# EAGLE design IC test1 (EAGLE 6.6.0)
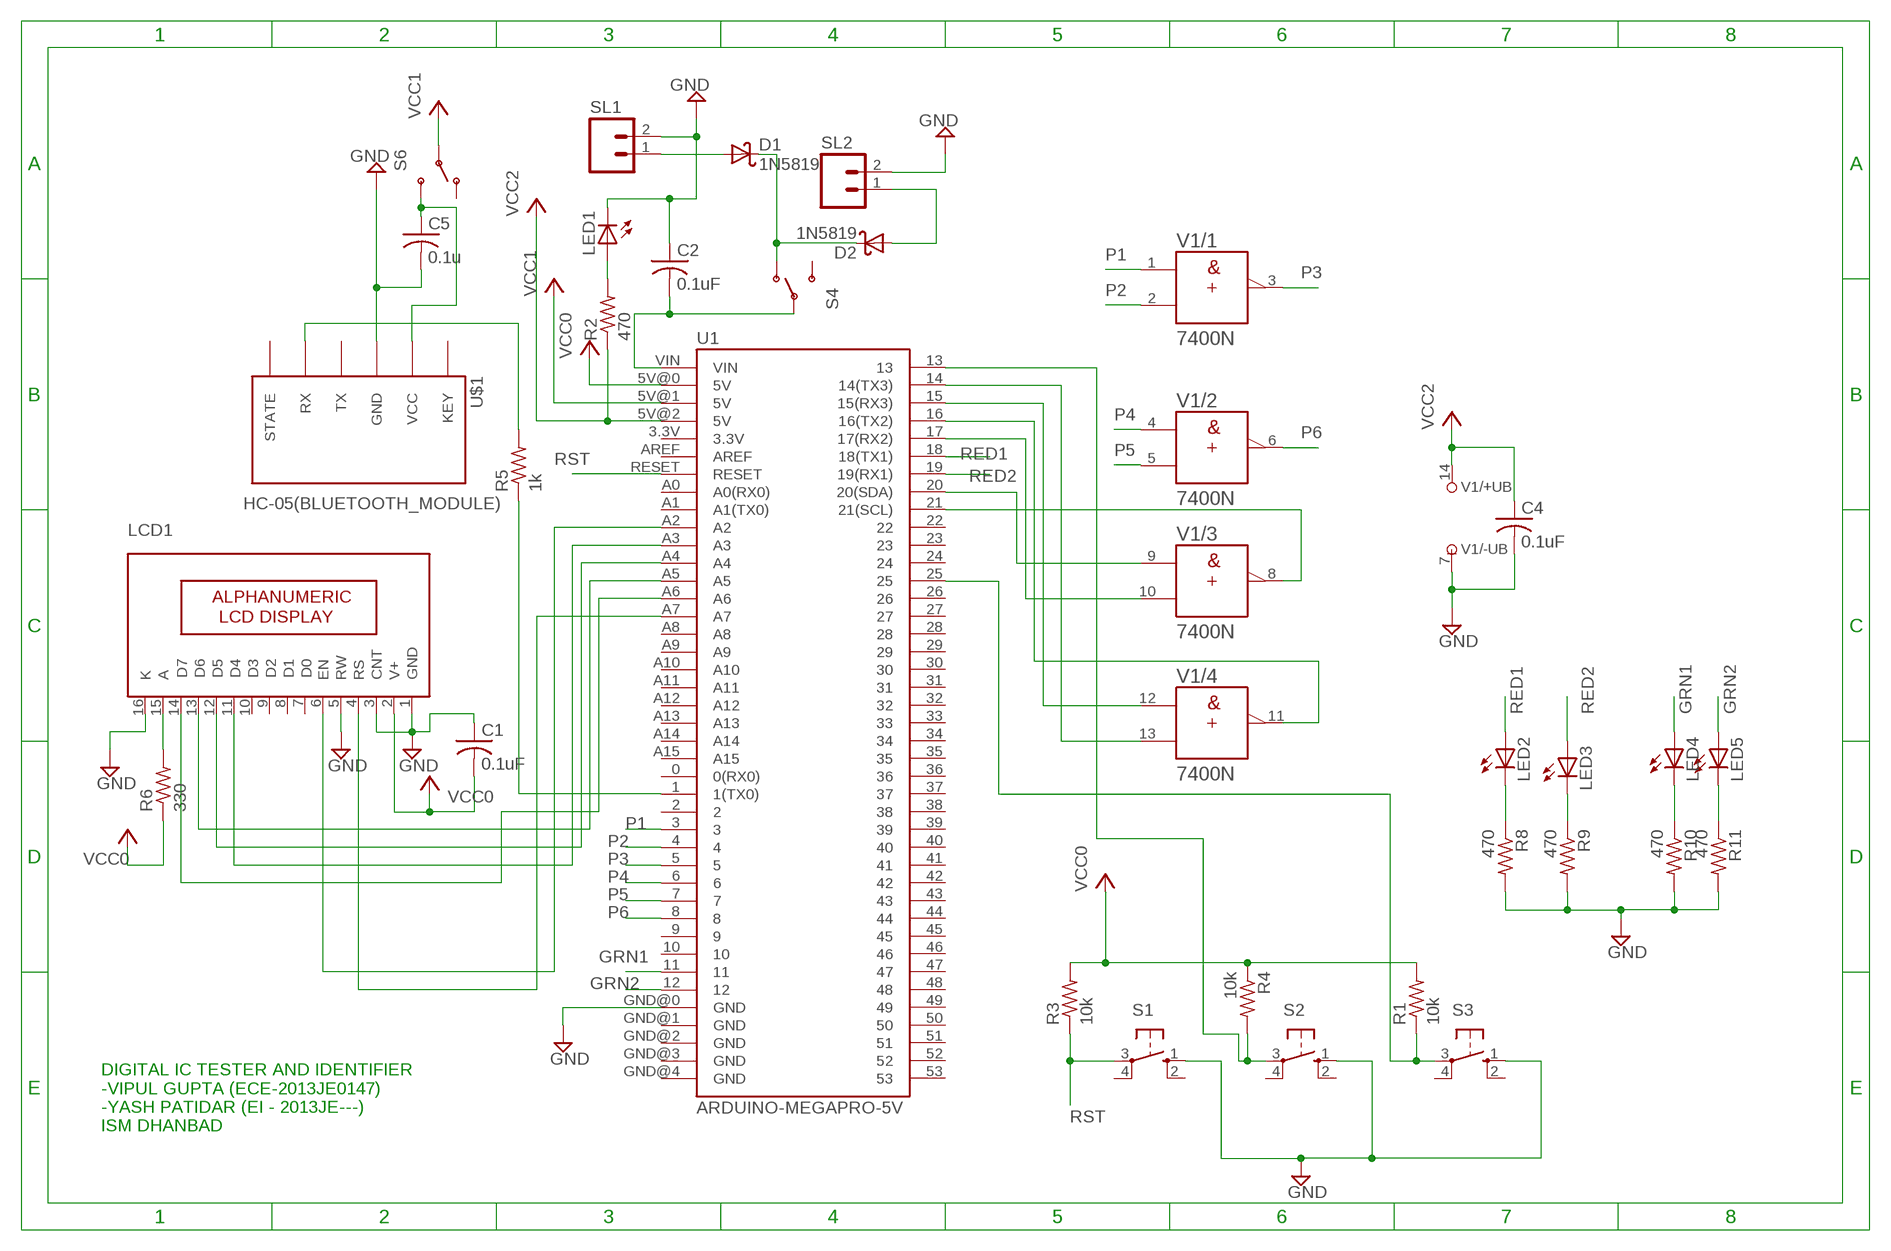
[diagram p0: schematic, sheet 1]

## Parts
C1  0.1uF  C-US025-024X044  [C025-024X044]
C2  0.1uF  C-US025-024X044  [C025-024X044]
C4  0.1uF  C-US025-024X044  [C025-024X044]
C5  0.1u  C-US025-024X044  [C025-024X044]
D1  1N5819  [DO41-10]
D2  1N5819  [DO41-10]
LCD1  16X2LCD  [16X2_LCD]
LED1  LED5MM  [LED5MM]
LED2  LED5MM  [LED5MM]
LED3  LED5MM  [LED5MM]
LED4  LED5MM  [LED5MM]
LED5  LED5MM  [LED5MM]
R1  10k  R-US_0204/7  [0204/7]
R2  470  R-US_0204/7  [0204/7]
R3  10k  R-US_0204/7  [0204/7]
R4  10k  R-US_0204/7  [0204/7]
R5  1k  R-US_0204/7  [0204/7]
R6  330  R-US_0204/7  [0204/7]
R8  470  R-US_0204/7  [0204/7]
R9  470  R-US_0204/7  [0204/7]
R10  470  R-US_0204/7  [0204/7]
R11  470  R-US_0204/7  [0204/7]
S1  40-XX  [B3F-40XX]
S2  40-XX  [B3F-40XX]
S3  40-XX  [B3F-40XX]
S4  SWITCH-SPDTPTH  [SWITCH-SPDT]
S6  SWITCH-SPDTPTH  [SWITCH-SPDT]
SL1  M02  [02P]
SL2  M02  [02P]
U1  ARDUINO-MEGAPRO-5V  [ARDUINO_MEGA-PRO-5V]
U$1  HC-05(BLUETOOTH_MODULE)  [HC-05]
V1  7400N  [DIL14]

## Nets
GND: C1.1 C2.1 C4.2 C5.2 LCD1.1(GND) LCD1.3(CNT) LCD1.5(RW) LCD1.16(K) LED1.K(C) R8.2 R9.2 R10.2 R11.2 S1.1(S) S2.1(S) S3.1(S) SL1.2 SL2.2 U1.GND@0(GND) U$1.GND V1.7(/-UB:-UB)
GRN1: LED4.A U1.11
GRN2: LED5.A U1.12
N$1: LCD1.15(A) R6.2
N$2: R5.2 U$1.RX
N$3: LCD1.4(RS) U1.A7
N$4: LCD1.6(EN) U1.A2
N$5: LCD1.11(D4) U1.A3
N$6: LCD1.12(D5) U1.A4
N$7: LCD1.13(D6) U1.A5
N$8: LCD1.14(D7) U1.A6
N$10: D1.C D2.C S4.1(O)
N$11: D2.A SL2.1
N$12: C2.2 S4.2(P) U1.VIN
N$13: D1.A SL1.1
N$14: C5.1 S6.3(S) U$1.VCC
N$15: U1.14(14(TX3)) V1.13(/4:B)
N$16: R4.2 S2.3(P) U1.13
N$17: R1.1 S3.3(P) U1.25
N$18: U1.15(15(RX3)) V1.12(/4:A)
N$19: LED1.A R2.2
N$20: U1.16(16(TX2)) V1.11(/4:Y)
N$21: U1.17(17(RX2)) V1.10(/3:B)
N$22: U1.20(20(SDA)) V1.9(/3:A)
N$23: U1.21(21(SCL)) V1.8(/3:Y)
N$29: LED2.K(C) R8.1
N$30: LED3.K(C) R9.1
N$31: LED4.K(C) R10.1
N$32: LED5.K(C) R11.1
N$33: R5.1 U1.1(1(TX0))
P1: U1.3 V1.1(/1:A)
P2: U1.4 V1.2(/1:B)
P3: U1.5 V1.3(/1:Y)
P4: U1.6 V1.4(/2:A)
P5: U1.7 V1.5(/2:B)
P6: U1.8 V1.6(/2:Y)
RED1: LED2.A U1.18(18(TX1))
RED2: LED3.A U1.19(19(RX1))
RST: R3.1 S1.3(P) U1.RESET
VCC0: C1.2 LCD1.2(V+) R1.2 R3.2 R4.1 R6.1 U1.5V@0(5V) ; supply symbol labelled VCC
VCC3: R2.1 S6.2(P) U1.5V@2(5V) ; supply symbol labelled VCC2, VCC1
VCC4: C4.1 U1.5V@1(5V) V1.14(/+UB:+UB) ; supply symbol labelled VCC1, VCC2
Unconnected: LCD1.7(D0) LCD1.8(D1) LCD1.9(D2) LCD1.10(D3) S1.2(S1) S1.4(P1) S2.2(S1) S2.4(P1) S3.2(S1) S3.4(P1) S4.3(S) S6.1(O) U1.0(0(RX0)) U1.2 U1.3.3V U1.9 U1.10 U1.22 U1.23 U1.24 U1.26 U1.27 U1.28 U1.29 U1.30 U1.31 U1.32 U1.33 U1.34 U1.35 U1.36 U1.37 U1.38 U1.39 U1.40 U1.41 U1.42 U1.43 U1.44 U1.45 U1.46 U1.47 U1.48 U1.49 U1.50 U1.51 U1.52 U1.53 U1.A0(A0(RX0)) U1.A1(A1(TX0)) U1.A8 U1.A9 U1.A10 U1.A11 U1.A12 U1.A13 U1.A14 U1.A15 U1.AREF U1.GND@1(GND) U1.GND@2(GND) U1.GND@3(GND) U1.GND@4(GND) U$1.KEY U$1.STATE U$1.TX

## Notes on the sheet
- DIGITAL IC TESTER AND IDENTIFIER
  -VIPUL GUPTA (ECE-2013JE0147)
  -YASH PATIDAR (EI - 2013JE---)
  ISM DHANBAD

## Library data of the parts
C1 C2 C4 C5 = resistor:C-US: CAPACITOR, American symbol
D1 D2 = CEDT_JANUARY_2015_v5:1N5819: DIODE general purpose rectifier, 1 A
LCD1 = CEDT_JANUARY_2015_v5:16X2LCD: ALPHANUMERIC-LCD
LED1-LED5 = CEDT_JANUARY_2015_v5:LED
R1-R6 R8-R11 = rcl:R-US_: RESISTOR, American symbol
S1-S3 = switch-omron:40-XX: OMRON SWITCH; MF: OMRON COMPONENTS USA; MPN: B3F-4000; OC_FARNELL: 176434; OC_NEWARK: 36K3105
S4 S6 = SparkFun-Electromechanical:SWITCH-SPDT: SPDT Switch Simple slide switch, Spark Fun Electronics SKU : COM-00102 DPDT SMT slide switch, AYZ0202, SWCH-08179; PROD_ID: SWCH-08261
SL1 SL2 = CEDT_JANUARY_2015_v5:M02: AMP QUICK CONNECTOR
U1 = SparkFun-Boards:ARDUINO-MEGA: Arduino Mega board footprint
U$1 = CEDT_JANUARY_2015_v5:HC-05(BLUETOOTH_MODULE)
V1 = 74ttl-din:74*00: Quad 2-input NAND gate

## Net classes
0 default: width 0.406 mm
1 VCC: width 0.61 mm

## Board
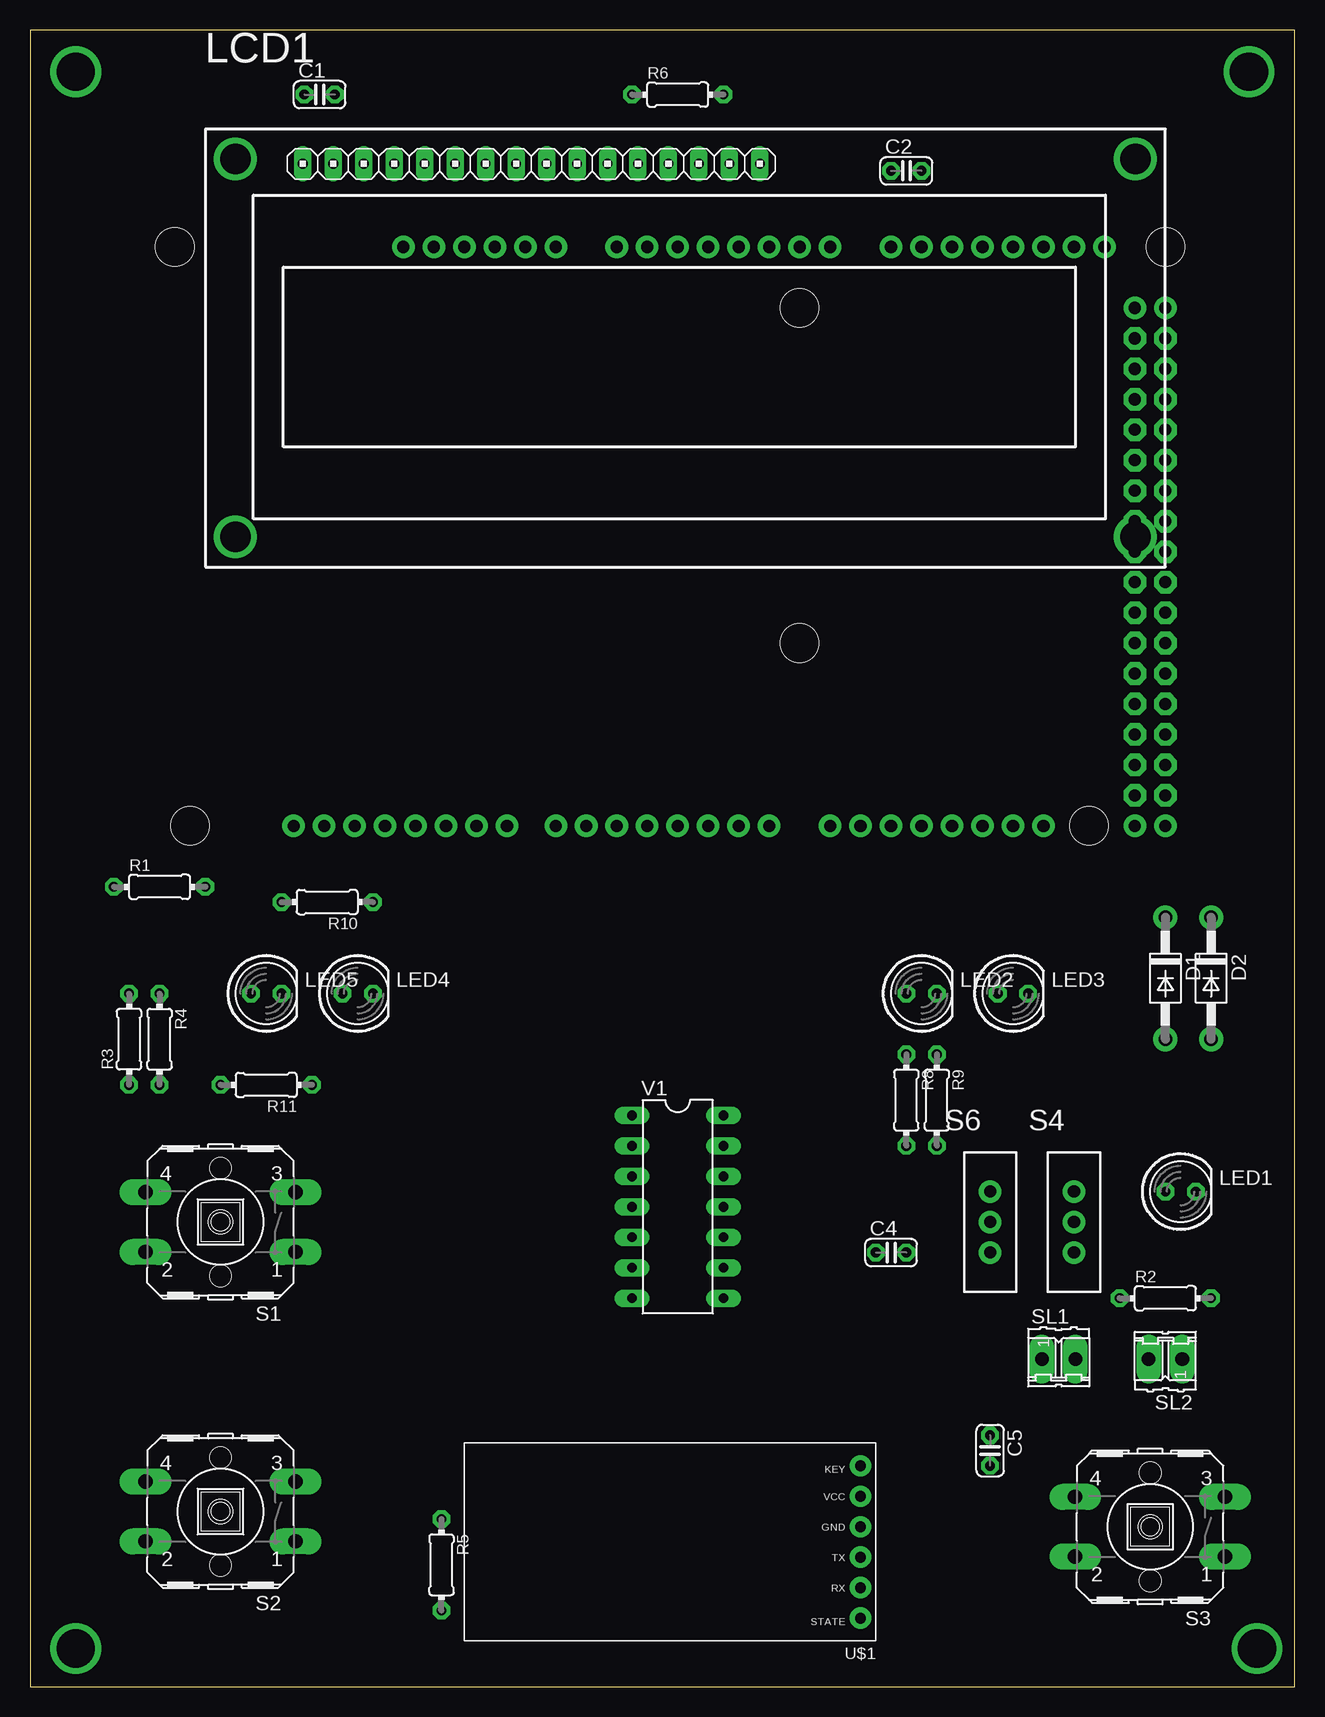
[diagram p1: board, top side]
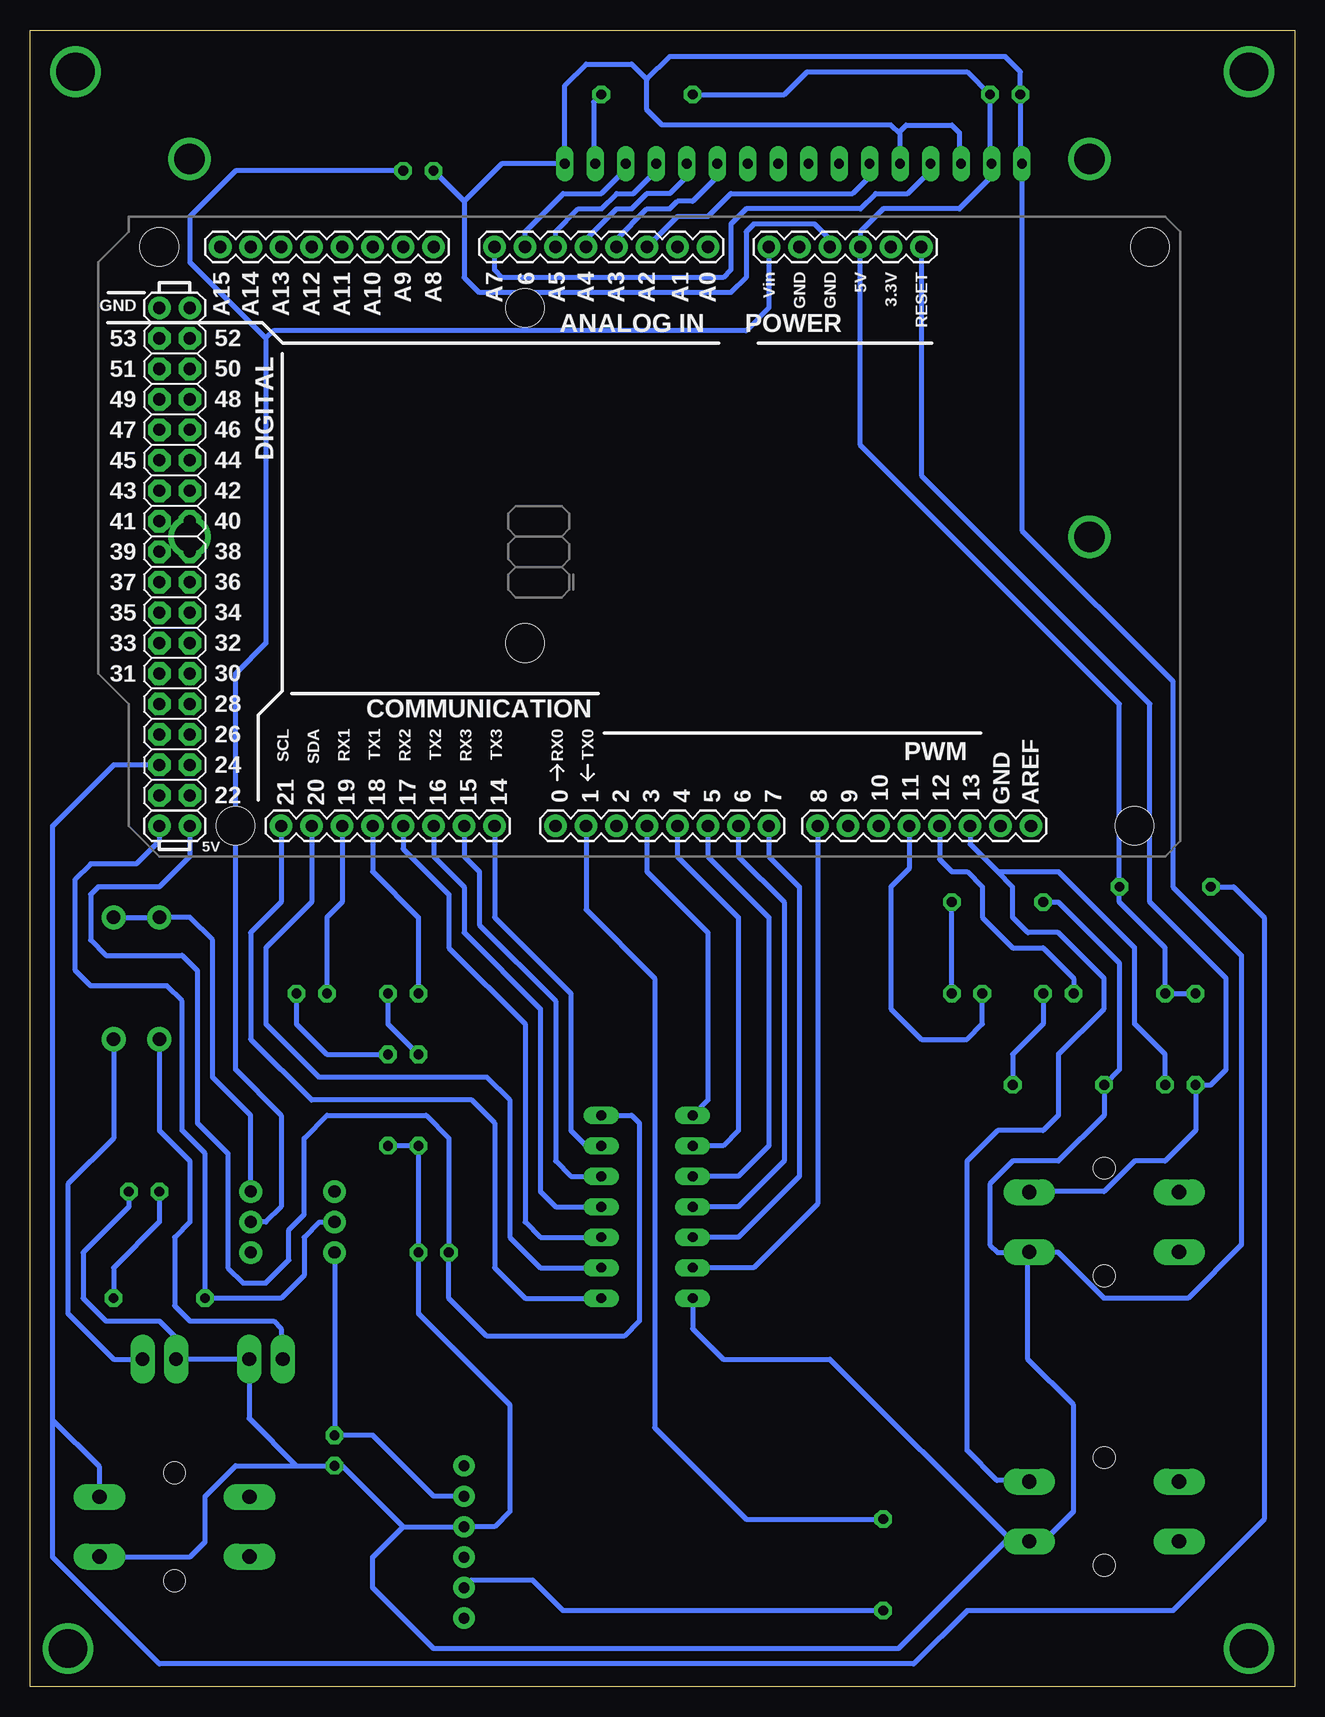
[diagram p2: board, bottom side, seen from below]

Size 105.39 x 138.1 mm. Coordinates in mm from the lower left corner, seen from the top.
Outline: 0,0 105.39,0 105.39,138.1 0,138.1 0,0
Copper layers (1*16): Top 0.035mm / dielectric 1.5mm / Bottom 0.035mm
Design rules "default *": minimum track width 10mil, minimum drill 24mil, track to track 8mil, track to pad 8mil, pad to pad 8mil, via to via 8mil, smd to smd 8mil, copper to edge 40mil, drill to drill 8mil, minimum pad ring 10mil, minimum via ring 8mil, stop-mask expansion 4mil, vias tented up to drill 0mil, thermal gap 10mil

### Footprints (pad centres in the part's own frame; a part is rotated, then mirrored left to right if it is on the bottom)
C025-024X044 = drill 0.813 octagon: 1 -1.27,0; 2 1.27,0
DO41-10 = drill 1.118: A 5.08,0; C -5.08,0
16X2_LCD = drill 0.813 long: 1 8.12,33.608; 2 10.66,33.608; 3 13.2,33.608; 4 15.74,33.608; 5 18.28,33.608; 6 20.82,33.608; 7 23.36,33.608; 8 25.9,33.608; 9 28.44,33.608; 10 30.98,33.608; 11 33.52,33.608; 12 36.06,33.608; 13 38.6,33.608; 14 41.14,33.608; 15 43.68,33.608; 16 46.22,33.608 | drill 2.54: P$1 2.5,34; P$2 2.5,2.5; P$3 77.5,2.5; P$4 77.5,34
LED5MM = drill 0.813 octagon: A -1.27,0; K 1.27,0
0204/7 = drill 0.813 octagon: 1 -3.81,0; 2 3.81,0
B3F-40XX = drill 1.194 long: 1 -6.248,2.489; 2 6.248,2.489; 3 -6.248,-2.489; 4 6.248,-2.489 | hole 1.803: 0,-4.496; 0,4.496
SWITCH-SPDT = drill 1.016 pad 1.88: 1 0,2.54; 2 0,0; 3 0,-2.54
02P = drill 1.143 long: 1 -1.397,0; 2 1.397,0
ARDUINO_MEGA-PRO-5V = drill 1.016 pad 1.88: 0 52.07,50.8; 1 49.53,50.8; 2 46.99,50.8; 3 44.45,50.8; 3.3V 24.13,2.54; 4 41.91,50.8; 5 39.37,50.8; 5V@0 26.67,2.54; 5V@1 82.55,50.8; 5V@2 85.09,50.8; 6 36.83,50.8; 7 34.29,50.8; 8 30.226,50.8; 9 27.686,50.8; 10 25.146,50.8; 11 22.606,50.8; 12 20.066,50.8; 13 17.526,50.8; 14 57.15,50.8; 15 59.69,50.8; 16 62.23,50.8; 17 64.77,50.8; 18 67.31,50.8; 19 69.85,50.8; 20 72.39,50.8; 21 74.93,50.8; A0 39.37,2.54; A1 41.91,2.54; A2 44.45,2.54; A3 46.99,2.54; A4 49.53,2.54; A5 52.07,2.54; A6 54.61,2.54; A7 57.15,2.54; A8 62.23,2.54; A9 64.77,2.54; A10 67.31,2.54; A11 69.85,2.54; A12 72.39,2.54; A13 74.93,2.54; A14 77.47,2.54; A15 80.01,2.54; AREF 12.446,50.8; GND@0 29.21,2.54; GND@1 31.75,2.54; GND@2 82.55,7.62; GND@3 85.09,7.62; GND@4 14.986,50.8; RESET 21.59,2.54; VIN 34.29,2.54 | drill 1.016 pad 1.88 octagon: 22 82.55,48.26; 23 85.09,48.26; 24 82.55,45.72; 25 85.09,45.72; 26 82.55,43.18; 27 85.09,43.18; 28 82.55,40.64; 29 85.09,40.64; 30 82.55,38.1; 31 85.09,38.1; 32 82.55,35.56; 33 85.09,35.56; 34 82.55,33.02; 35 85.09,33.02; 36 82.55,30.48; 37 85.09,30.48; 38 82.55,27.94; 39 85.09,27.94; 40 82.55,25.4; 41 85.09,25.4; 42 82.55,22.86; 43 85.09,22.86; 44 82.55,20.32; 45 85.09,20.32; 46 82.55,17.78; 47 85.09,17.78; 48 82.55,15.24; 49 85.09,15.24; 50 82.55,12.7; 51 85.09,12.7; 52 82.55,10.16; 53 85.09,10.16 | hole 3.2: 3.81,50.8; 2.54,2.54; 54.61,35.56; 54.61,7.62; 78.74,50.8; 85.09,2.54
HC-05 = drill 0.9 pad 1.778: GND -16.51,-1.27; KEY -16.51,-6.35; RX -16.51,3.81; STATE -16.51,6.35; TX -16.51,1.27; VCC -16.51,-3.81
DIL14 = drill 0.813 long: 1 -7.62,-3.81; 2 -5.08,-3.81; 3 -2.54,-3.81; 4 0,-3.81; 5 2.54,-3.81; 6 5.08,-3.81; 7 7.62,-3.81; 8 7.62,3.81; 9 5.08,3.81; 10 2.54,3.81; 11 0,3.81; 12 -2.54,3.81; 13 -5.08,3.81; 14 -7.62,3.81

### Placement (x,y rotation side)
C1  24.13,132.72 0 top
C2  73.03,126.36 0 top
C4  71.75,36.2 0 top
C5  80.01,19.68 270 top
D1  94.61,59.05 270 top
D2  98.42,59.05 270 top
LCD1  14.61,93.34 0 top
LED1  95.89,41.27 0 top
LED2  74.3,57.78 0 top
LED3  81.92,57.78 0 top
LED4  27.3,57.78 0 top
LED5  19.68,57.78 0 top
R1  10.79,66.67 0 top
R2  94.61,32.38 0 top
R3  8.26,53.98 90 top
R4  10.79,53.98 270 top
R5  34.29,10.16 270 top
R6  53.98,132.72 0 top
R8  73.03,48.9 270 top
R9  75.56,48.9 270 top
R10  24.77,65.41 180 top
R11  19.68,50.16 180 top
S1  15.88,38.73 180 top
S2  15.88,14.61 180 top
S3  93.34,13.34 180 top
S4  87,38.73 0 top
S6  80.01,38.73 0 top
SL1  85.72,27.3 0 top
SL2  94.61,27.3 180 top
U1  9.53,122.56 180 bottom
U$1  52.7,12.06 180 top
V1  53.98,40.01 270 top

### Tracks (layer width: path | path; a pad name or v marks a point on that pad's centre or on a via)
GND
  Bottom 0.406: 32.88,129.41 LCD1.5 33.07,126.95 | 32.88,129.41 33.66,130.18 52.7,130.18 53.98,131.44 53.98,133.99 | 53.98,133.99 55.24,135.25 59.05,135.25 60.83,133.49 LCD1.16 66.09,126.95 69.22,123.83 | 53.98,133.99 52.07,135.89 24.13,135.89 22.86,134.62 C1.1 22.86,127.09 LCD1.1 22.73,96.39 10.16,83.82 10.16,66.67 4.45,60.96 4.45,36.83 8.89,32.38 15.88,32.38 19.74,36.25 S1.1 | U1.GND@0 38.73,120.65 40.01,121.92 45.09,121.92 45.72,121.28 45.72,117.47 46.99,116.2 67.94,116.2 69.22,117.47 69.22,123.83 | S2.1 23.55,12.12 | R9.2 R8.2 C4.2 73.03,31.11 65.41,23.5 65.41,14.61 66.67,13.34 U$1.GND 74.3,13.34 | 83.19,18.41 87.12,22.35 SL1.2 SL2.2 93.34,27.43 93.34,29.21 94.61,30.48 99.06,30.48 100.97,32.38 100.97,36.2 97.16,40.01 LED1.K | 83.19,18.41 C5.2 79.38,18.41 74.3,13.34 | S3.1 92.02,10.85 90.81,12.06 90.81,15.88 88.27,18.41 83.19,18.41 | 74.3,13.34 76.83,10.79 76.83,8.26 71.75,3.17 33.02,3.17 24.13,12.06 23.5,12.06 | R10.2 19.68,65.41 14.61,60.33 14.61,51.44 R11.2 15.88,47.62 19.68,43.81 23.5,43.81 25.4,41.91 25.4,36.83 24.77,36.2 22.17,36.2 S1.1 | 23.55,12.12 23.5,12.06 | 23.5,12.06 20.95,12.06 18.41,14.61 18.41,23.5 22.23,27.3 22.23,36.14 S1.1 | C2.1 69.22,123.83 | V1.7 50.16,29.84 47.62,27.3 38.73,27.3 23.55,12.12 | LCD1.3 27.94,127.09 27.94,129.54 28.57,130.18 32.38,130.18 32.88,129.68 32.88,129.41
GRN1
  Bottom 0.406: U1.11 32.13,68.2 33.66,66.67 33.66,56.52 31.11,53.98 27.3,53.98 26.04,55.24 LED4.A
GRN2
  Bottom 0.406: U1.12 29.59,68.96 28.57,67.94 27.3,67.94 26.04,66.67 26.04,64.14 23.5,61.59 20.95,61.59 18.41,59.05 LED5.A
N$1
  Bottom 0.406: R6.2 58.42,132.08 58.42,127.09 LCD1.15
N$2
  Bottom 0.406: R5.2 60.96,6.35 63.5,8.89 68.58,8.89 U$1.RX
N$3
  Bottom 0.406: LCD1.4 30.34,126.36 32.25,124.46 34.92,124.46 36.2,123.19 45.72,123.19 46.99,121.92 46.99,118.11 47.62,117.47 66.04,117.47 66.67,118.11 U1.A7
N$4
  Bottom 0.406: LCD1.6 35.42,125.86 36.83,124.46 46.99,124.46 48.9,122.56 51.44,122.56 U1.A2
N$5
  Bottom 0.406: LCD1.11 48.12,125.86 50.16,123.83 51.44,123.83 52.07,123.19 53.98,123.19 56.52,120.65 U1.A3
N$6
  Bottom 0.406: LCD1.12 50.66,125.86 52.07,124.46 53.98,124.46 55.24,123.19 56.52,123.19 59.05,120.65 U1.A4
N$7
  Bottom 0.406: LCD1.13 53.2,126.36 55.11,124.46 56.52,124.46 57.78,123.19 59.69,123.19 61.59,121.28 U1.A5
N$8
  Bottom 0.406: LCD1.14 55.74,126.5 57.78,124.46 60.96,124.46 64.14,121.28 U1.A6
N$10
  Bottom 0.406: D2.C D1.C 92.08,64.14 90.17,62.23 90.17,50.8 87,47.62 S4.1
N$11
  Bottom 0.406: SL2.1 98.42,27.3 102.23,31.11 102.23,41.91 98.42,45.72 D2.A
N$12
  Bottom 0.406: U1.VIN 43.81,114.94 45.72,113.03 85.09,113.03 85.72,112.39 | S4.2 85.72,38.73 84.45,40.01 84.45,47.62 88.27,51.44 88.27,84.45 85.72,87 85.72,112.39 | 85.72,112.39 92.08,118.75 92.08,122.56 88.27,126.36 C2.2
N$13
  Bottom 0.406: SL1.1 84.45,27.43 84.45,29.84 85.09,30.48 92.08,30.48 93.34,31.75 93.34,37.47 92.08,38.73 92.08,43.81 94.61,46.35 D1.A
N$14
  Bottom 0.406: S6.3 C5.1 76.83,20.95 71.75,15.88 U$1.VCC
N$15
  Bottom 0.406: U1.14 66.67,64.14 60.33,57.78 60.33,46.35 59.05,45.09 V1.13
N$16
  Bottom 0.406: U1.13 27.05,70.23 24.77,67.94 | 24.77,67.94 19.68,67.94 13.34,61.59 13.34,55.24 10.79,52.7 R4.2 | S2.3 22.23,17.2 24.82,17.2 27.3,19.68 27.3,43.81 24.77,46.35 20.95,46.35 19.68,47.62 19.68,52.7 15.88,56.52 15.88,59.05 19.68,62.87 22.23,62.87 23.5,64.14 23.5,66.67 24.77,67.94
N$17
  Bottom 0.406: U1.25 98.42,76.83 103.5,71.75 103.5,22.23 | S3.3 99.59,18.31 103.5,22.23 | 103.5,22.23 103.5,10.79 94.61,1.91 31.75,1.91 27.3,6.35 10.16,6.35 2.54,13.97 2.54,64.14 5.08,66.67 R1.1
N$18
  Bottom 0.406: U1.15 69.22,69.22 67.94,67.94 67.94,63.5 61.59,57.15 61.59,43.81 60.33,42.55 V1.12
N$19
  Bottom 0.406: LED1.A 94.61,38.73 98.42,34.92 R2.2
N$20
  Bottom 0.406: U1.16 71.75,69.22 69.22,66.67 69.22,62.87 62.87,56.52 62.87,41.27 61.59,40.01 V1.11
N$21
  Bottom 0.406: U1.17 74.3,69.85 70.48,66.04 70.48,61.59 64.14,55.24 64.14,38.73 62.87,37.47 V1.10
N$22
  Bottom 0.406: U1.20 81.92,65.41 85.72,61.59 85.72,55.24 81.28,50.8 67.31,50.8 65.41,48.9 65.41,37.47 62.87,34.92 V1.9
N$23
  Bottom 0.406: U1.21 84.45,65.41 87,62.87 87,53.98 81.92,48.9 68.58,48.9 66.67,46.99 66.67,34.92 64.14,32.38 V1.8
N$24  (via drill 3.2)
  other vias: 3.81,134.62
N$25  (via drill 3.2)
  other vias: 101.6,134.62
N$26  (via drill 3.2)
  other vias: 3.81,3.17
N$27  (via drill 3.2)
  other vias: 102.23,3.17
N$29
  Bottom 0.406: LED2.K 75.56,55.24 R8.1
N$30
  Bottom 0.406: LED3.K 83.19,55.24 80.64,52.7 R9.1
N$31
  Bottom 0.406: LED4.K R10.1
N$32
  Bottom 0.406: LED5.K 20.95,55.24 23.5,52.7 R11.1
N$33
  Bottom 0.406: U1.1 59.05,64.77 53.34,59.05 53.34,21.59 45.72,13.97 R5.1
P1
  Bottom 0.406: U1.3 53.98,67.94 48.9,62.87 48.9,48.9 V1.1
P2
  Bottom 0.406: U1.4 51.44,69.22 46.35,64.14 46.35,46.35 47.62,45.09 V1.2
P3
  Bottom 0.406: U1.5 48.9,69.22 43.81,64.14 43.81,45.09 46.35,42.55 V1.3
P4
  Bottom 0.406: U1.6 46.35,69.22 42.55,65.41 42.55,43.81 46.35,40.01 V1.4
P5
  Bottom 0.406: U1.7 43.81,69.22 41.27,66.67 41.27,42.55 46.35,37.47 V1.5
P6
  Bottom 0.406: U1.8 39.75,40.26 45.09,34.92 V1.6
RED1
  Bottom 0.406: U1.18 76.83,67.94 73.03,64.14 LED2.A
RED2
  Bottom 0.406: U1.19 79.38,65.41 80.64,64.14 LED3.A
RST
  Bottom 0.406: U1.RESET 31.11,100.97 12.06,81.92 12.06,65.41 5.71,59.05 5.71,51.44 6.99,50.16 R3.1 8.26,46.35 10.79,43.81 13.34,43.81 15.88,41.27 22.07,41.27 S1.3
VCC0
  Bottom 0.406: 25.4,127.09 C1.2 27.3,134.62 40.64,134.62 42.55,132.72 R6.1 | 25.4,127.09 LCD1.2 | 25.4,127.09 25.4,125.73 27.94,123.19 34.29,123.19 36.2,121.28 U1.5V@0 36.2,103.5 14.61,81.92 R1.2 14.61,65.41 10.79,61.59 R4.1 R3.2
VCC3
  Bottom 0.406: S6.2 81.28,38.73 82.55,37.47 82.55,34.29 84.45,32.38 R2.1 90.81,44.45 92.71,46.35 92.71,57.15 93.98,58.42 100.33,58.42 101.6,59.69 101.6,67.31 100.33,68.58 96.52,68.58 94.61,70.48 U1.5V@2
VCC4
  Bottom 0.406: U1.5V@1 92.08,69.22 94.61,66.67 99.69,66.67 100.33,66.04 100.33,62.23 99.06,60.96 92.71,60.96 91.44,59.69 91.44,46.99 88.9,44.45 88.9,34.92 87.63,33.66 85.72,33.66 83.82,35.56 83.82,38.1 82.55,39.37 82.55,45.72 80.64,47.62 72.39,47.62 70.48,45.72 C4.1 70.48,32.38 67.31,29.21 55.88,29.21 54.61,30.48 54.61,46.99 55.24,47.62 V1.14